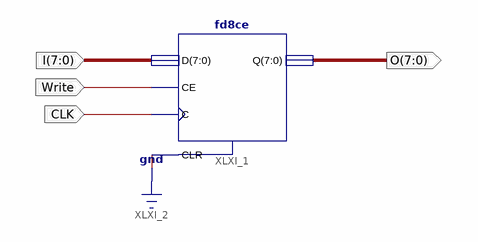
[diagram p0: schematic sheet 1]
// Xilinx ISE schematic HardwareTriggerStore.sch (spartan3e) as structural Verilog: 1 symbols, 4 ports
module HardwareTriggerStore (
  input  [7:0] I,
  input  Write,
  input  CLK,
  output [7:0] O
);

  fd8ce XLXI_1 (.C(CLK), .CE(Write), .CLR(1'b0), .D(I), .Q(O));
endmodule
